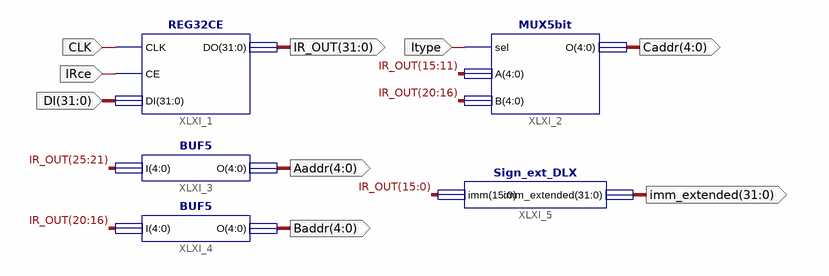
[diagram p0: schematic sheet 1]
// Xilinx ISE schematic IR_DLX.sch (spartan6) as structural Verilog: 5 symbols, 9 ports
module IR_DLX (
  input  CLK,
  input  IRce,
  input  [31:0] DI,
  input  Itype,
  output [31:0] IR_OUT,
  output [4:0] Aaddr,
  output [4:0] Baddr,
  output [31:0] imm_extended,
  output [4:0] Caddr
);

  REG32CE XLXI_1 (.CLK(CLK), .CE(IRce), .DI(DI), .DO(IR_OUT));
  BUF5 XLXI_3 (.I(IR_OUT[25:21]), .O(Aaddr));
  BUF5 XLXI_4 (.I(IR_OUT[20:16]), .O(Baddr));
  MUX5bit XLXI_2 (.sel(Itype), .A(IR_OUT[15:11]), .B(IR_OUT[20:16]), .O(Caddr));
  Sign_ext_DLX XLXI_5 (.imm(IR_OUT[15:0]), .imm_extended(imm_extended));
endmodule
